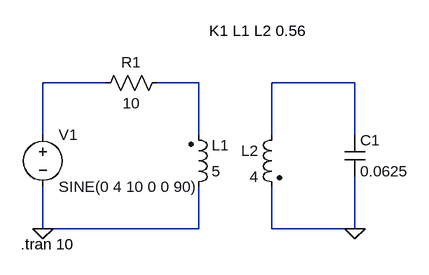
[diagram p0: schematic mutual-inductance.asc]
mutual-inductance.asc, the LTspice schematic file:
Version 4
SHEET 1 880 680
WIRE 224 48 128 48
WIRE 368 48 304 48
WIRE 608 48 480 48
WIRE 128 128 128 48
WIRE 368 128 368 48
WIRE 480 128 480 48
WIRE 608 128 608 48
WIRE 128 272 128 208
WIRE 368 272 368 208
WIRE 368 272 128 272
WIRE 480 272 480 208
WIRE 608 272 608 192
WIRE 608 272 480 272
FLAG 128 272 0
FLAG 608 272 0
SYMBOL voltage 128 112 R0
WINDOW 123 0 0 Left 0
WINDOW 39 0 0 Left 0
SYMATTR InstName V1
SYMATTR Value SINE(0 4 10 0 0 90)
SYMBOL res 320 32 R90
WINDOW 0 0 56 VBottom 2
WINDOW 3 32 56 VTop 2
SYMATTR InstName R1
SYMATTR Value 10
SYMBOL ind2 352 224 M180
WINDOW 0 36 80 Left 2
WINDOW 3 36 40 Left 2
SYMATTR InstName L1
SYMATTR Value 5
SYMBOL ind2 496 112 M0
SYMATTR InstName L2
SYMATTR Value 4
SYMBOL cap 592 128 R0
SYMATTR InstName C1
SYMATTR Value 0.0625
TEXT 384 -32 Left 2 !K1 L1 L2 0.56
TEXT 94 296 Left 2 !.tran 10

The netlist it stands for:
* mutual-inductance.asc
V1 N001 0 SINE(0 4 10 0 0 90)
R1 N002 N001 10
L1 0 N002 5
L2 N003 0 4
C1 N003 0 0.0625
K1 L1 L2 0.56
.tran 10
.backanno
.end